# EAGLE design v3 (EAGLE 7.5.0)
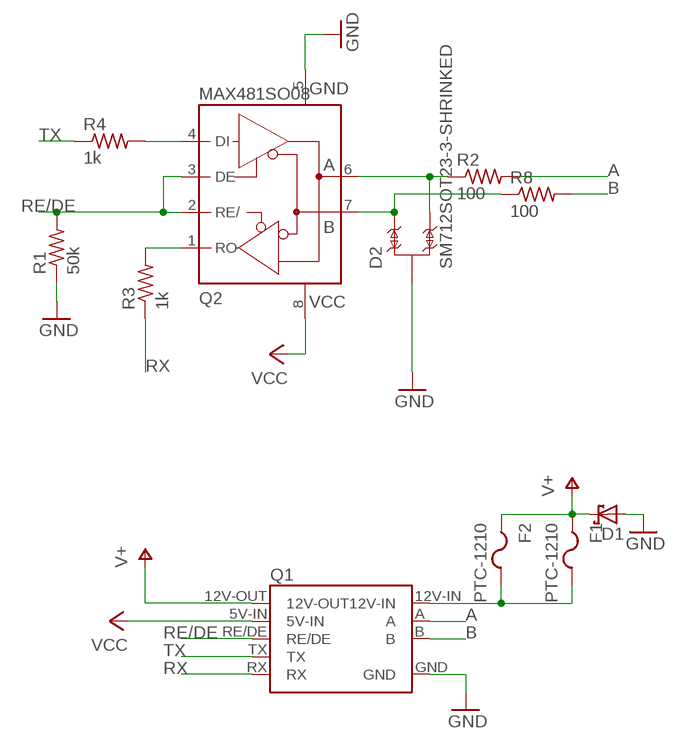
[diagram p0: schematic, sheet 1]

## Parts
D1  SCHOTTKY-DIODESMC  [SMC]
D2  SM712SOT23-3-SHRINKED  [SOT23-3-SHRINKED]
F1  PTC-1210  [1210]
F2  PTC-1210  [1210]
Q1  RS485-ADAPTER0.05-CONNECTOR  [RS485-ADAPTOR-05]
Q2  MAX481SO08  [SO08]
R1  50k  R-US_R0603  [R0603]
R2  100  R-US_R0603  [R0603]
R3  1k  R-US_R0603  [R0603]
R4  1k  R-US_R0603  [R0603]
R8  100  R-US_R0603  [R0603]

## Nets
12V-IN: F1.2 F2.2 Q1.12V-IN
A: Q1.A R2.2
B: Q1.B R8.2
GND: D1.A D2.3 Q1.GND Q2.5(GND) R1.1
N$4: D2.2 Q2.7(B) R8.1
N$5: Q2.1(RO) R3.2
N$6: Q2.4(DI) R4.2
N$9: D2.1 Q2.6(A) R2.1
RE/DE: Q1.RE/DE Q2.2(RE/) Q2.3(DE) R1.2
RX: Q1.RX R3.1
TX: Q1.TX R4.1
V+: D1.C F1.1 F2.1 Q1.12V-OUT
VCC: Q1.5V-IN Q2.8(+5V)

## Library data of the parts
D1 = diode:SCHOTTKY-DIODE: Schottky Diode
D2 = serge:SM712: SM712 Series 600W Asymmetrical TVS Diode Array; Datasheet: http://www.littelfuse.com/~/media/electronics/datasheets/tvs_diode_arrays/littelfuse_tvs_diode_array_sm712_datasheet.pdf.pdf
F1 F2 = serge:PTC-1210
Q1 = serge:RS485-ADAPTER
Q2 = serge:MAX481
R1-R4 R8 = adafruit:R-US_: RESISTOR, American symbol

## Board
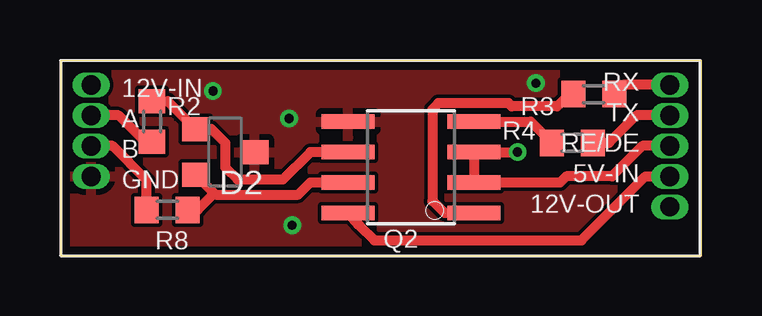
[diagram p1: board, top side]
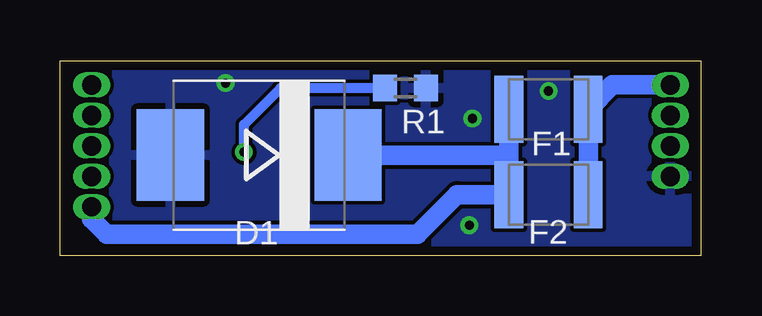
[diagram p2: board, bottom side, seen from below]

Size 26.72 x 8.12 mm. Coordinates in mm from the lower left corner, seen from the top.
Outline: 0,0 26.72,0 26.72,8.12 0,8.12 0,0
Copper layers (1*16): Top 0.0356mm / dielectric 1.5011mm / Bottom 0.0356mm
Design rules "LaenPCBOrder *": minimum track width 6mil, minimum drill 13mil, track to track 6mil, track to pad 6mil, pad to pad 6mil, via to via 6mil, smd to smd 6mil, copper to edge 15mil, drill to drill 6mil, minimum pad ring 4mil, minimum via ring 7mil, stop-mask expansion 4mil, vias tented up to drill 0mil, thermal gap 10mil

### Footprints (pad centres in the part's own frame; a part is rotated, then mirrored left to right if it is on the bottom)
SMC = smd 2.8 x 3.8: A 3.7,0; C -3.7,0
SOT23-3-SHRINKED = smd 1 x 1.146: 1 -0.95,-1.227; 2 0.95,-1.227; 3 0,1.227
1210 = smd 1.2 x 2.8: 1 -1.65,0; 2 1.65,0
RS485-ADAPTOR-05 = drill 0.8 pad 1.016 long: 5V-IN -11.43,1.27; 12V-IN 12.7,-2.54; 12V-OUT -11.43,2.54; A 12.7,-1.27; B 12.7,0; GND 12.7,1.27; RE/DE -11.43,0; RX -11.43,-2.54; TX -11.43,-1.27
SO08 = smd 0.61 x 2.21: 1 -1.905,-2.616; 2 -0.635,-2.616; 3 0.635,-2.616; 4 1.905,-2.616; 5 1.905,2.616; 6 0.635,2.616; 7 -0.635,2.616; 8 -1.905,2.616
R0603 = smd 1 x 1.1: 1 -0.85,0; 2 0.85,0

### Placement (x,y rotation side)
D1  18.41,4.19 180 bottom
D2  6.86,4.32 270 top
F1  6.35,6.1 0 bottom
F2  6.35,2.54 0 bottom
Q1  13.97,4.57 180 top
Q2  14.61,3.68 90 top
R1  12.32,6.99 180 bottom
R2  3.81,5.59 270 top
R3  22.23,6.73 180 top
R4  21.34,4.7 180 top
R8  4.45,1.9 180 top

### Tracks (layer width: path | path; a pad name or v marks a point on that pad's centre or on a via)
12V-IN
  Bottom 0.813: F2.2 F1.2 3.68,7.11 Q1.12V-IN
A
  Top 0.406: R2.2 3.52,4.74 2.41,5.84 Q1.A
B
  Top 0.406: R8.2 3.6,3.14 2.16,4.57 Q1.B
GND  (via drill 0.38)
  other vias: 9.53,5.71 9.65,1.27 6.35,6.86 19.81,7.19
  pour Bottom: 0,0 26.67,0 26.67,8 0,8
  pour Top: 0,0 26.67,0 26.67,8 0,8
N$4
  Top 0.406: 6.4,2.6 6.46,2.54 9.91,2.54 10.41,3.05 Q2.7 | 6.4,2.6 D2.2 | R8.1 5.71,1.9 6.4,2.6
N$5
  Top 0.406: Q2.1 16,1.78 15.49,2.29 15.49,6.1 15.75,6.35 18.67,6.35 18.8,6.22 20.7,6.22 21.21,6.73 R3.2
N$6
  Top 0.406: Q2.4 19.6,5.59 R4.2
N$9
  Top 0.406: R2.1 4.46,6.44 D2.1 6.29,5.27 6.86,4.7 6.86,3.68 7.37,3.18 9.27,3.18 10.41,4.32 Q2.6
RE/DE  (via drill 0.38)
  Top 0.406: v19.05,4.32 Q2.3 Q2.2 20.83,3.05 21.08,3.3 22.99,3.3 24.26,4.57 Q1.RE/DE
  Bottom 0.406: v19.05,4.32 19.05,5.46 17.53,6.99 R1.2
RX
  Top 0.406: 23.37,7.11 22.99,6.73 R3.1 23.46,7.11 Q1.RX
TX
  Top 0.406: R4.1 22.86,4.7 24,5.84 Q1.TX
V+
  Bottom 0.813: 8,3.81 F2.1 10.16,2.54 11.81,0.89 24.77,0.89 25.4,1.52 Q1.12V-OUT | 8,3.81 F1.1 | D1.C 8.38,4.19 8,3.81
VCC
  Top 0.406: Q2.8 12.45,1.27 13.08,0.64 21.72,0.64 24.38,3.3 Q1.5V-IN